# Altium schematic sheet adc-amp.SchDoc: ADC - Analog
size Letter; CheckedBy: J. Brinton; CompanyName: Signal Laboratories, Inc.; DrawnBy: J. Brinton; Engineer: J. Brinton; Address1: 3479 Edison Way; Address2: Menlo Park CA 94025; Address3: +1 (877) 778-8435; Address4: siglabs.com; Revision: 3; SheetNumber: 20; SheetTotal: 49; ModifiedDate: 4/20/2018
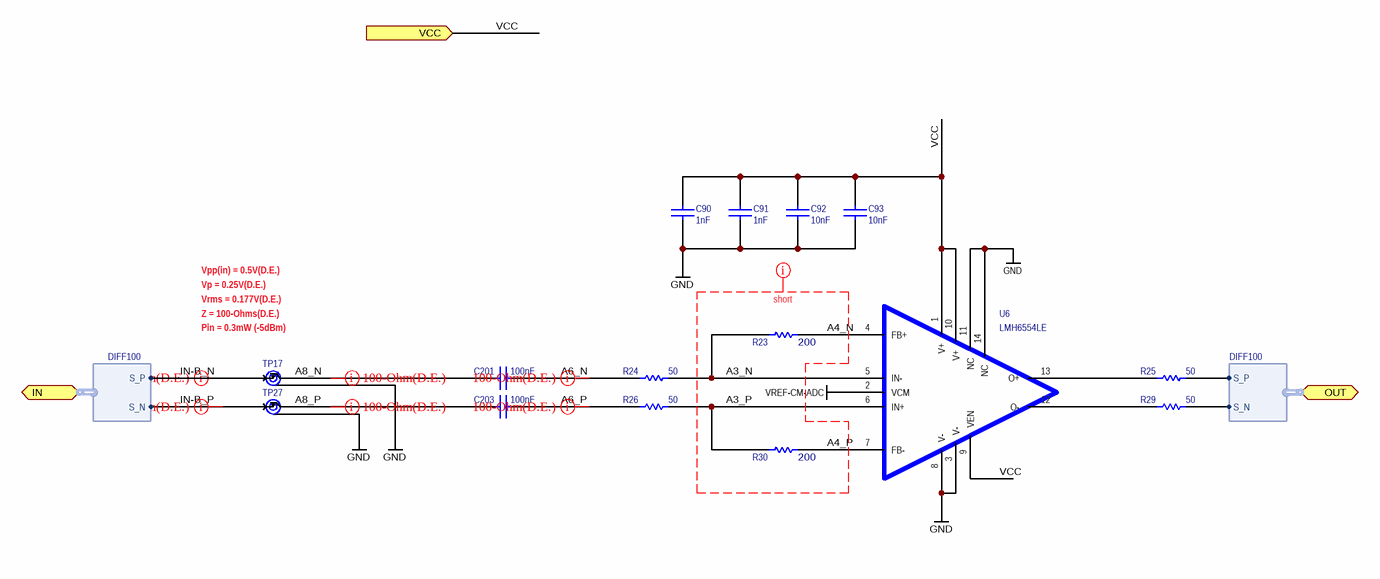
[diagram p0: adc-amp.SchDoc]

## Parts
C90  value 1nF  [CAPC100X50X55L25N]  (hidden comment: CGA2B2NP01H102J050BA)
C91  value 1nF  [CAPC100X50X55L25N]  (hidden comment: CGA2B2NP01H102J050BA)
C92  value 10nF  [CAPC100X50X55L25N]  (hidden comment: GRM155R71H103KA88)
C93  value 10nF  [CAPC100X50X55L25N]  (hidden comment: GRM155R71H103KA88)
C201  value 100nF  [CAPC100X50X55L25N]  (hidden comment: GRM155R71C104KA88J)
C203  value 100nF  [CAPC100X50X55L25N]  (hidden comment: GRM155R71C104KA88J)
R23  value 200  [RESC1608X55N]  (hidden comment: MCT06030C2000FP500)
R24  value 50  [RESC1005X40N]  (hidden comment: FC0402E50R0BST1)
R25  value 50  [RESC1005X40N]  (hidden comment: FC0402E50R0BST1)
R26  value 50  [RESC1005X40N]  (hidden comment: FC0402E50R0BST1)
R29  value 50  [RESC1005X40N]  (hidden comment: FC0402E50R0BST1)
R30  value 200  [RESC1608X55N]  (hidden comment: MCT06030C2000FP500)
TP17  MS-180(20)  [MS-180(20)]  (value not drawn)
TP27  MS-180(20)  [MS-180(20)]  (value not drawn)
U6  LMH6554LE  [NHJ0014A]

## Ports
IN (harness DIFF100), OUT (harness DIFF100), VCC (in)

## Harnesses
DIFF100: S_P, S_N

## Nets
GND: C90.1 C91.1 C92.1 C93.1 TP17.G(GND) TP27.G(GND) U6.3(V-) U6.8(V-) U6.11(NC) U6.14(NC)
VREF-CM-ADC: U6.2(VCM)
A3_N: R23.1 R24.2 U6.5(IN-)
A3_P: R26.2 R30.1 U6.6(IN+)
A4_N: R23.2 U6.4(FB+)
A4_P: R30.2 U6.7(FB-)
A6_N: C201.2 R24.1
A6_P: C203.2 R26.1
A8_N: C201.1 TP17.A(OUT)
A8_P: C203.1 TP27.A(OUT)
IN-B_N: TP17.C(IN) ; port IN.S_P
IN-B_P: TP27.C(IN) ; port IN.S_N
VCC: C90.2 C91.2 C92.2 C93.2 U6.1(V+) U6.9(VEN) U6.10(V+) ; port VCC
NetR25_1: R25.1 U6.13(O+)
NetR25_2: R25.2 ; port OUT.S_P
NetR29_1: R29.1 U6.12(O-)
NetR29_2: R29.2 ; port OUT.S_N

## Layout directives
net class short: A3_N, A3_P, A4_N, A4_P
differential pair; net class z100diff12; Name: 100-Ohm(D.E.); net class rf: A6_N, A6_P, A8_N, A8_P, IN-B_N, IN-B_P

## Notes on the sheet
- Vpp(in) = 0.5V(D.E.)
- Vp = 0.25V(D.E.)
- Vrms = 0.177V(D.E.)
- (near TP17) Pin = 0.3mW (-5dBm)
- Z = 100-Ohms(D.E.)
- Title
- Engineer
- Revision
- Drawn By
- Checked By
- Date
- Sheet
- of

## Library data of the parts
C90 C91 = CAP 0402: Ceramic Capacitor 1nF ±5% 50V NP0 0402; Manufacturer: TDK; Tr: -55:150; Voltage: 50V; Manufacturer P/N: CGA2B2NP01H102J050BA; Package: 0402; Tolerance: ±5%
C92 C93 = CAP 0402: Ceramic Capacitor 10nF ±10% 50V X7R 0402; Manufacturer: Murata; Tr: -55:125; Voltage: 50V; Manufacturer P/N: GRM155R71H103KA88; Package: 0402; Tolerance: ±10%
C201 C203 = CAP 0402: Ceramic Capacitor 100nF ±10% 16V X7R 0402; Manufacturer: Murata; Tr: -55:125; Voltage: 16V; Manufacturer P/N: GRM155R71C104KA88J; Package: 0402; Tolerance: ±10%
R23 R30 = RES 0603: Thin Film Resistor 200 Ohm ±1% 0603; Manufacturer: Vishay; Tr: -55:155; Package: 0603; Manufacturer P/N: MCT06030C2000FP500; Do Not Place: *; Tolerance: ±1%
R24-R26 R29 = RES 0603: Thin Film RF Resistor 50 Ohm ±0.1% 0402; Manufacturer: Vishay; Tr: -55:155; Package: 0402; Manufacturer P/N: FC0402E50R0BST1; Do Not Place: *; Tolerance: ±0.1%
TP17 TP27 = MS-180(20): Coaxial Connector Switch; Manufacturer: Hirose; Manufacturer P/N: MS-180(20)
U6 = LMH6554LE: 2.8 GHz Ultra Linear Fully Differential Amplifier; Manufacturer: Texas Instruments; Manufacturer P/N: LMH6554LE